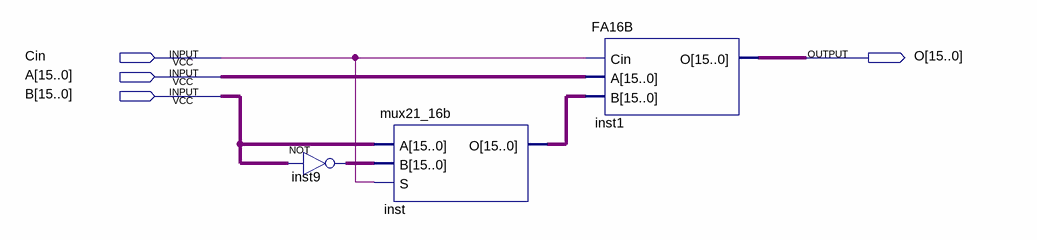
[diagram p0: schematic sheet]
// Quartus schematic AddSub.bdf as structural Verilog: 3 symbols, 4 pins
module AddSub (
  input  Cin,
  input  [15:0] A,
  input  [15:0] B,
  output [15:0] O
);

  wire [15:0] inst9_out, inst_o;

  assign inst9_out = ~B;  // NOT inst9, 16 bits wide
  mux21_16b inst (.A(B), .B(inst9_out), .S(Cin), .O(inst_o));
  FA16B inst1 (.Cin(Cin), .A(A), .B(inst_o), .O(O));
endmodule
